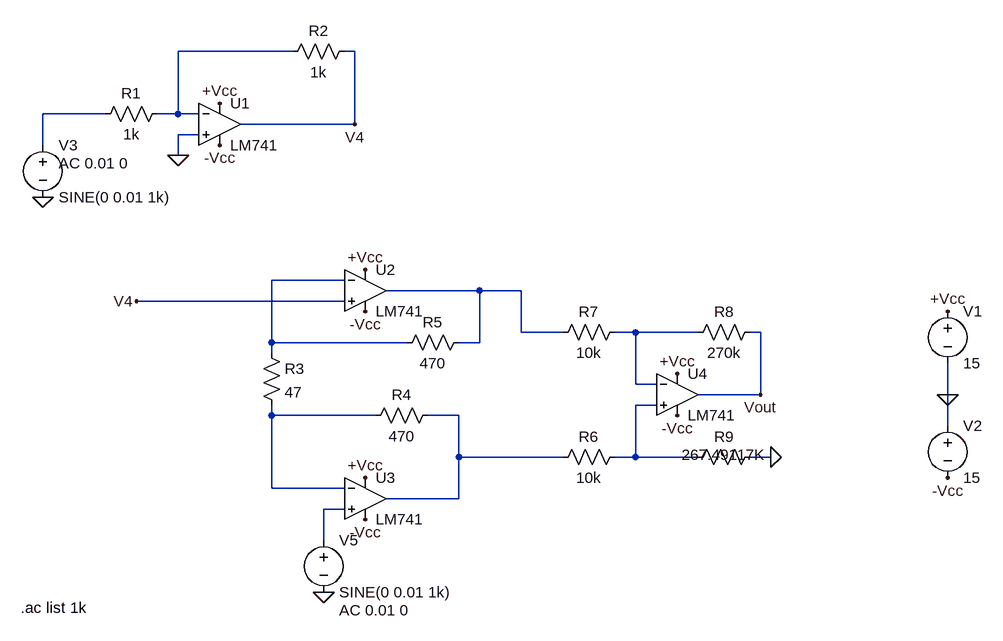
[diagram p0: schematic Diff gain.asc]
Diff gain.asc, the LTspice schematic file:
Version 4
SHEET 1 880 680
WIRE -512 -368 -688 -368
WIRE -416 -368 -432 -368
WIRE -800 -272 -896 -272
WIRE -688 -272 -688 -368
WIRE -688 -272 -720 -272
WIRE -656 -272 -688 -272
WIRE -416 -256 -416 -368
WIRE -416 -256 -592 -256
WIRE -656 -240 -688 -240
WIRE -896 -224 -896 -272
WIRE -688 -208 -688 -240
WIRE -432 -16 -544 -16
WIRE -224 0 -368 0
WIRE -160 0 -224 0
WIRE -432 16 -752 16
WIRE -160 64 -160 0
WIRE -96 64 -160 64
WIRE 16 64 -16 64
WIRE 112 64 16 64
WIRE 208 64 192 64
WIRE -544 80 -544 -16
WIRE -336 80 -544 80
WIRE -224 80 -224 0
WIRE -224 80 -256 80
WIRE -544 96 -544 80
WIRE 16 144 16 64
WIRE 48 144 16 144
WIRE 208 160 208 64
WIRE 208 160 112 160
WIRE 496 160 496 112
WIRE 48 176 16 176
WIRE -544 192 -544 176
WIRE -384 192 -544 192
WIRE -256 192 -304 192
WIRE 496 208 496 160
WIRE -256 256 -256 192
WIRE -96 256 -256 256
WIRE 16 256 16 176
WIRE 16 256 -16 256
WIRE 112 256 16 256
WIRE 224 256 192 256
WIRE -544 304 -544 192
WIRE -432 304 -544 304
WIRE -256 320 -256 256
WIRE -256 320 -368 320
WIRE -432 336 -464 336
WIRE -464 384 -464 336
FLAG 496 160 0
FLAG 496 32 +Vcc
FLAG 496 288 -Vcc
FLAG -896 -144 0
FLAG -688 -208 0
FLAG -416 -256 V4
FLAG -624 -288 +Vcc
FLAG -624 -224 -Vcc
FLAG -400 -32 +Vcc
FLAG -400 32 -Vcc
FLAG -400 288 +Vcc
FLAG -400 352 -Vcc
FLAG -464 464 0
FLAG 224 256 0
FLAG 80 128 +Vcc
FLAG 80 192 -Vcc
FLAG 208 160 Vout
FLAG -752 16 V4
SYMBOL voltage 496 16 R0
WINDOW 123 0 0 Left 0
WINDOW 39 0 0 Left 0
SYMATTR InstName V1
SYMATTR Value 15
SYMBOL voltage 496 192 R0
WINDOW 123 0 0 Left 0
WINDOW 39 0 0 Left 0
SYMATTR InstName V2
SYMATTR Value 15
SYMBOL voltage -896 -240 R0
WINDOW 123 24 44 Left 2
WINDOW 39 0 0 Left 0
SYMATTR InstName V3
SYMATTR Value SINE(0 0.01 1k)
SYMATTR Value2 AC 0.01 0
SYMBOL res -704 -288 R90
WINDOW 0 0 56 VBottom 2
WINDOW 3 32 56 VTop 2
SYMATTR InstName R1
SYMATTR Value 1k
SYMBOL res -416 -384 R90
WINDOW 0 0 56 VBottom 2
WINDOW 3 32 56 VTop 2
SYMATTR InstName R2
SYMATTR Value 1k
SYMBOL OpAmps\\LM741 -624 -320 R0
SYMATTR InstName U1
SYMBOL OpAmps\\LM741 -400 -64 R0
SYMATTR InstName U2
SYMBOL OpAmps\\LM741 -400 256 R0
SYMATTR InstName U3
SYMBOL res -560 80 R0
SYMATTR InstName R3
SYMATTR Value 47
SYMBOL res -240 64 R90
WINDOW 0 0 56 VBottom 2
WINDOW 3 32 56 VTop 2
SYMATTR InstName R5
SYMATTR Value 470
SYMBOL res -288 176 R90
WINDOW 0 0 56 VBottom 2
WINDOW 3 32 56 VTop 2
SYMATTR InstName R4
SYMATTR Value 470
SYMBOL voltage -464 368 R0
WINDOW 123 24 124 Left 2
WINDOW 39 0 0 Left 0
SYMATTR InstName V5
SYMATTR Value SINE(0 0.01 1k)
SYMATTR Value2 AC 0.01 0
SYMBOL res 0 48 R90
WINDOW 0 0 56 VBottom 2
WINDOW 3 32 56 VTop 2
SYMATTR InstName R7
SYMATTR Value 10k
SYMBOL res 0 240 R90
WINDOW 0 0 56 VBottom 2
WINDOW 3 32 56 VTop 2
SYMATTR InstName R6
SYMATTR Value 10k
SYMBOL res 208 48 R90
WINDOW 0 0 56 VBottom 2
WINDOW 3 32 56 VTop 2
SYMATTR InstName R8
SYMATTR Value 270k
SYMBOL res 208 240 R90
WINDOW 0 0 56 VBottom 2
WINDOW 3 28 56 VBottom 2
SYMATTR InstName R9
SYMATTR Value 267.49117K
SYMBOL OpAmps\\LM741 80 96 R0
SYMATTR InstName U4
TEXT -930 488 Left 2 !.ac list 1k

The netlist it stands for:
* Diff gain.asc
V1 +Vcc 0 15
V2 0 -Vcc 15
V3 N002 0 SINE(0 0.01 1k) AC 0.01 0
R1 N001 N002 1k
R2 V4 N001 1k
XU1 0 N001 +Vcc -Vcc V4 LM741  ; pins In+ In- V+ V- OUT
XU2 V4 N003 +Vcc -Vcc N004 LM741  ; pins In+ In- V+ V- OUT
XU3 N009 N007 +Vcc -Vcc N008 LM741  ; pins In+ In- V+ V- OUT
R3 N003 N007 47
R5 N004 N003 470
R4 N008 N007 470
V5 N009 0 SINE(0 0.01 1k) AC 0.01 0
R7 N005 N004 10k
R6 N006 N008 10k
R8 Vout N005 270k
R9 0 N006 267.49117K
XU4 N006 N005 +Vcc -Vcc Vout LM741  ; pins In+ In- V+ V- OUT
.ac list 1k
.lib LM741.lib
.backanno
.end